# Altium schematic sheet RS232.SchDoc
size A4
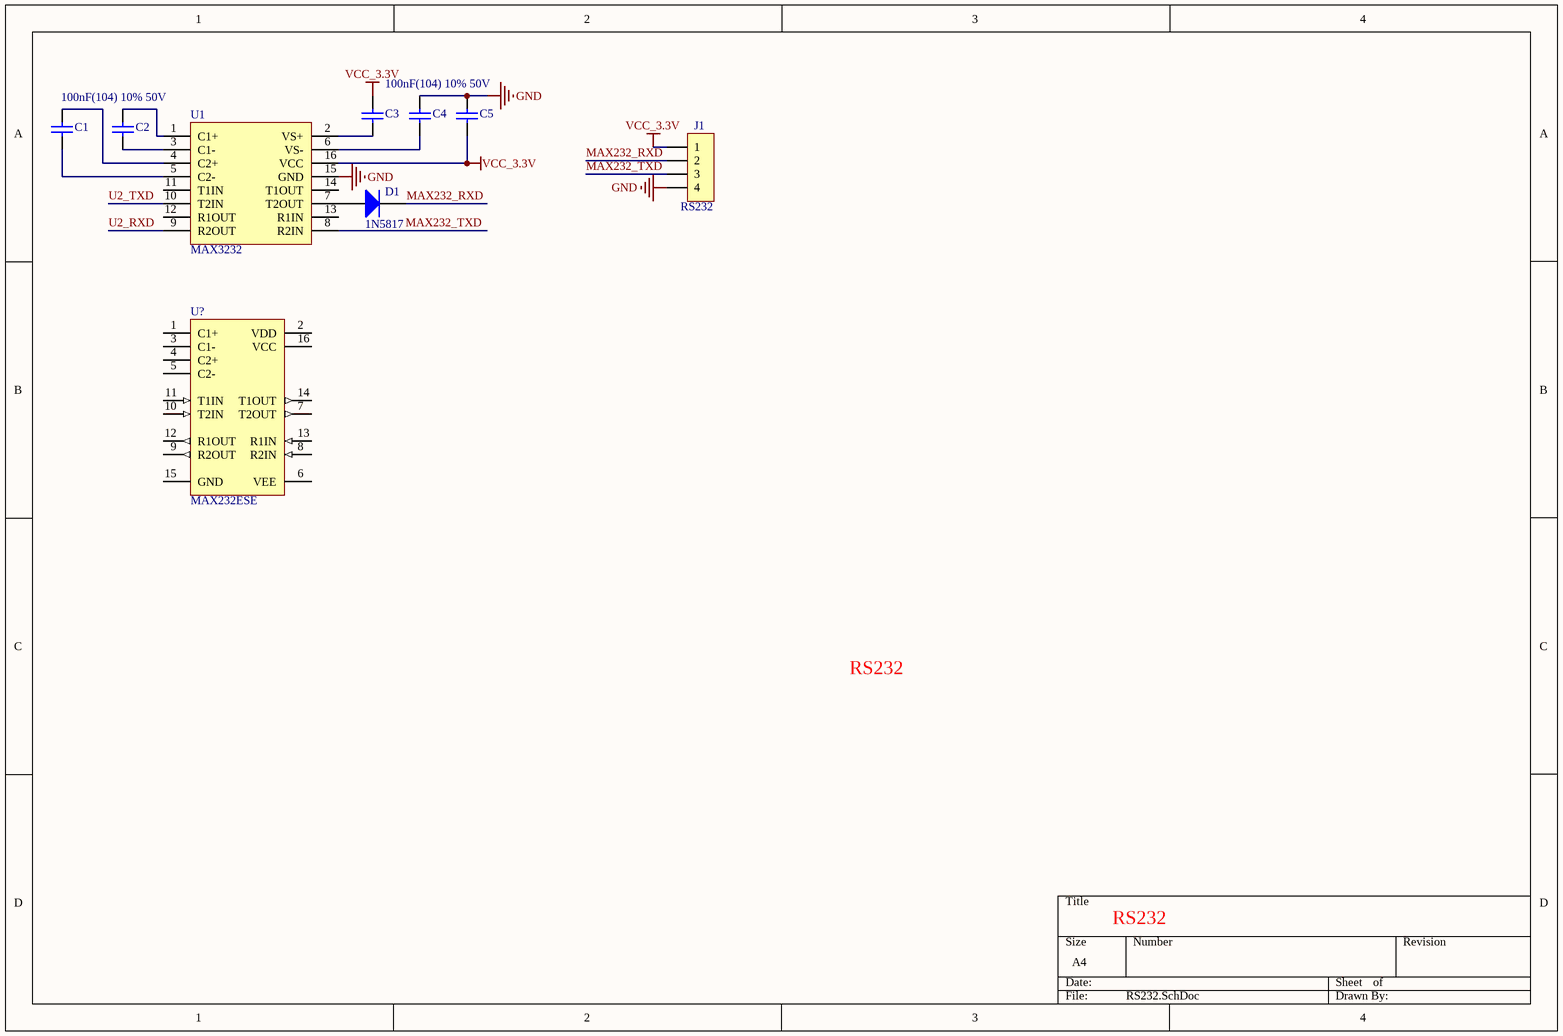
[diagram p0: RS232.SchDoc]

## Parts
C1  100nF(104) 10% 50V  [CAPC_0603_2]
C2  100nF(104) 10% 50V  [CAPC_0603_2]  (value not drawn)
C3  100nF(104) 10% 50V  [CAPC_0603_2]  (value not drawn)
C4  100nF(104) 10% 50V  [CAPC_0603_2]  (value not drawn)
C5  100nF(104) 10% 50V  [CAPC_0603_2]
D1  1N5817  [DO214_SMA]
J1  XH_2.54_4P  [XH_2.54_4P]  (value not drawn)
U1  MAX3232  [SOIC_16]
U?  MAX232ESE  [SOIC-16_150mil]

## Nets
GND: C4.1 C5.1 J1.4 U1.15(GND)
VCC_3.3V: C3.1 C5.2 J1.1 U1.16(VCC)
MAX232_RXD: D1.2(K) J1.2
MAX232_TXD: J1.3 U1.8(R2IN)
U2_RXD: U1.9(R2OUT)
U2_TXD: U1.10(T2IN)
NetC1_1: C1.1 U1.4(C2+)
NetC1_2: C1.2 U1.5(C2-)
NetC2_1: C2.1 U1.1(C1+)
NetC2_2: C2.2 U1.3(C1-)
NetC3_2: C3.2 U1.2(VS+)
NetC4_2: C4.2 U1.6(VS-)
NetD1_1: D1.1(A) U1.7(T2OUT)

Not connected (* = marked no-connect by the designer): U1 11(T1IN) 12(R1OUT) 13(R1IN) 14(T1OUT); U? 1(C1+) 2(VDD) 3(C1-) 4(C2+) 5(C2-) 6(VEE) 7(T2OUT) 8(R2IN) 9(R2OUT) 10(T2IN) 11(T1IN) 12(R1OUT) 13(R1IN) 14(T1OUT) 15(GND) 16(VCC)

## Notes on the sheet
- RS232
- (in symbol Header 4) RS232

## Library data of the parts
C1-C5 = 0805 100nF(104) 10% 50V: 贴片电容; ComponentLink1Description: 供应商链接; ComponentLink1URL: http://www.szlcsc.com/product/details_50686.html; Package: 0805; Supplier: LC; SuppliersPartNumber: C49678
D1 = Diode: Default Diode; Published: 8-Jun-2000; LatestRevisionDate: 17-Jul-2002; LatestRevisionNote: Re-released for DXP Platform.; PackageVersion: Sep-1996; PackageReference: SMC; Publisher: Altium Limited; Code_JEDEC: DO-214-AB; Value: 1N5817
J1 = Header 4: 4P接插件
U1 = MAX232
U? = MAX232ESE_[C26860]: RS232; ComponentLink1Description: 供应商链接; ComponentLink1URL: http://www.szlcsc.com/product/details_27608.html; Package: SOIC-16_150mil; Supplier: LC; SuppliersPartNumber: C26860